# EAGLE schematic teensy-jst_01.4_v5 (EAGLE 9.7.0)
Assembly variants: DNP
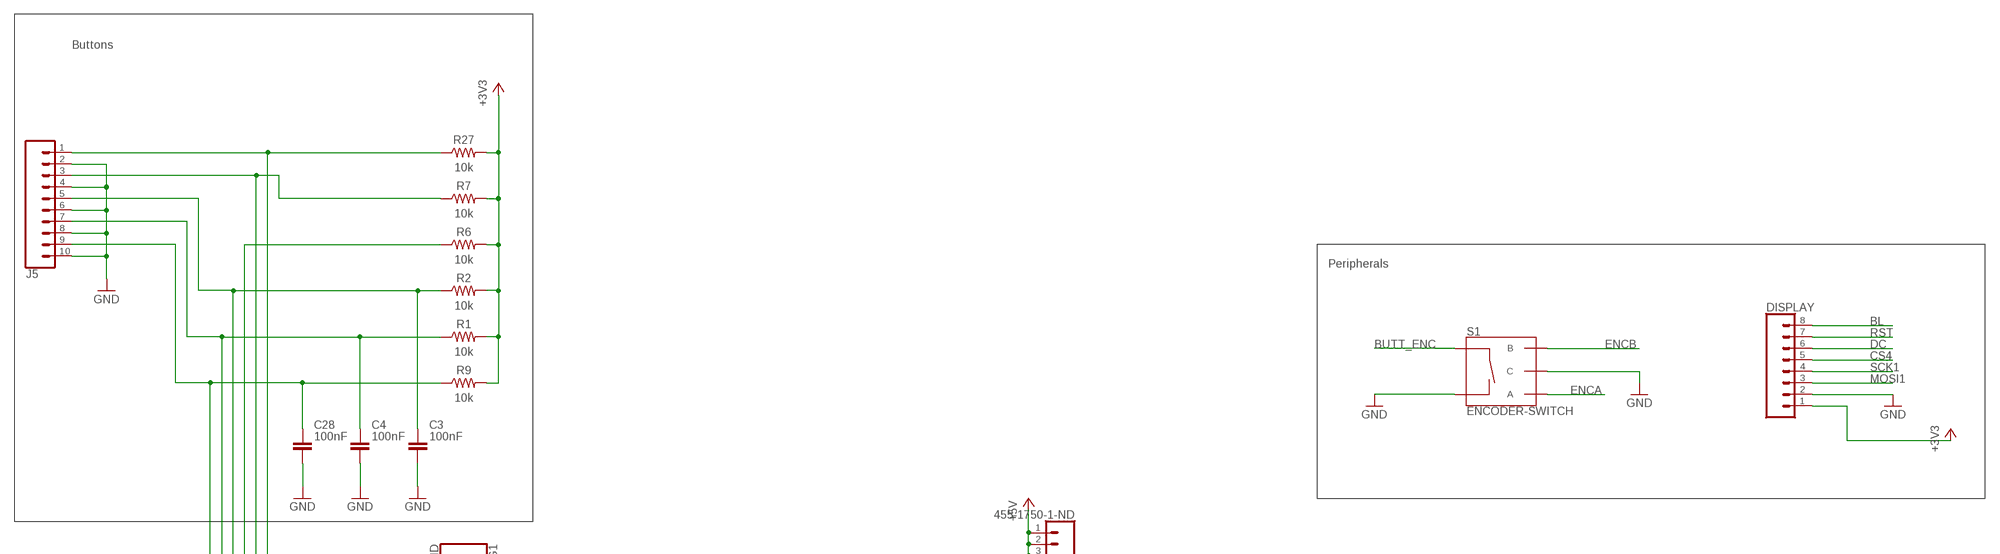
[diagram p0: schematic, sheet 1, part 1 of 3]
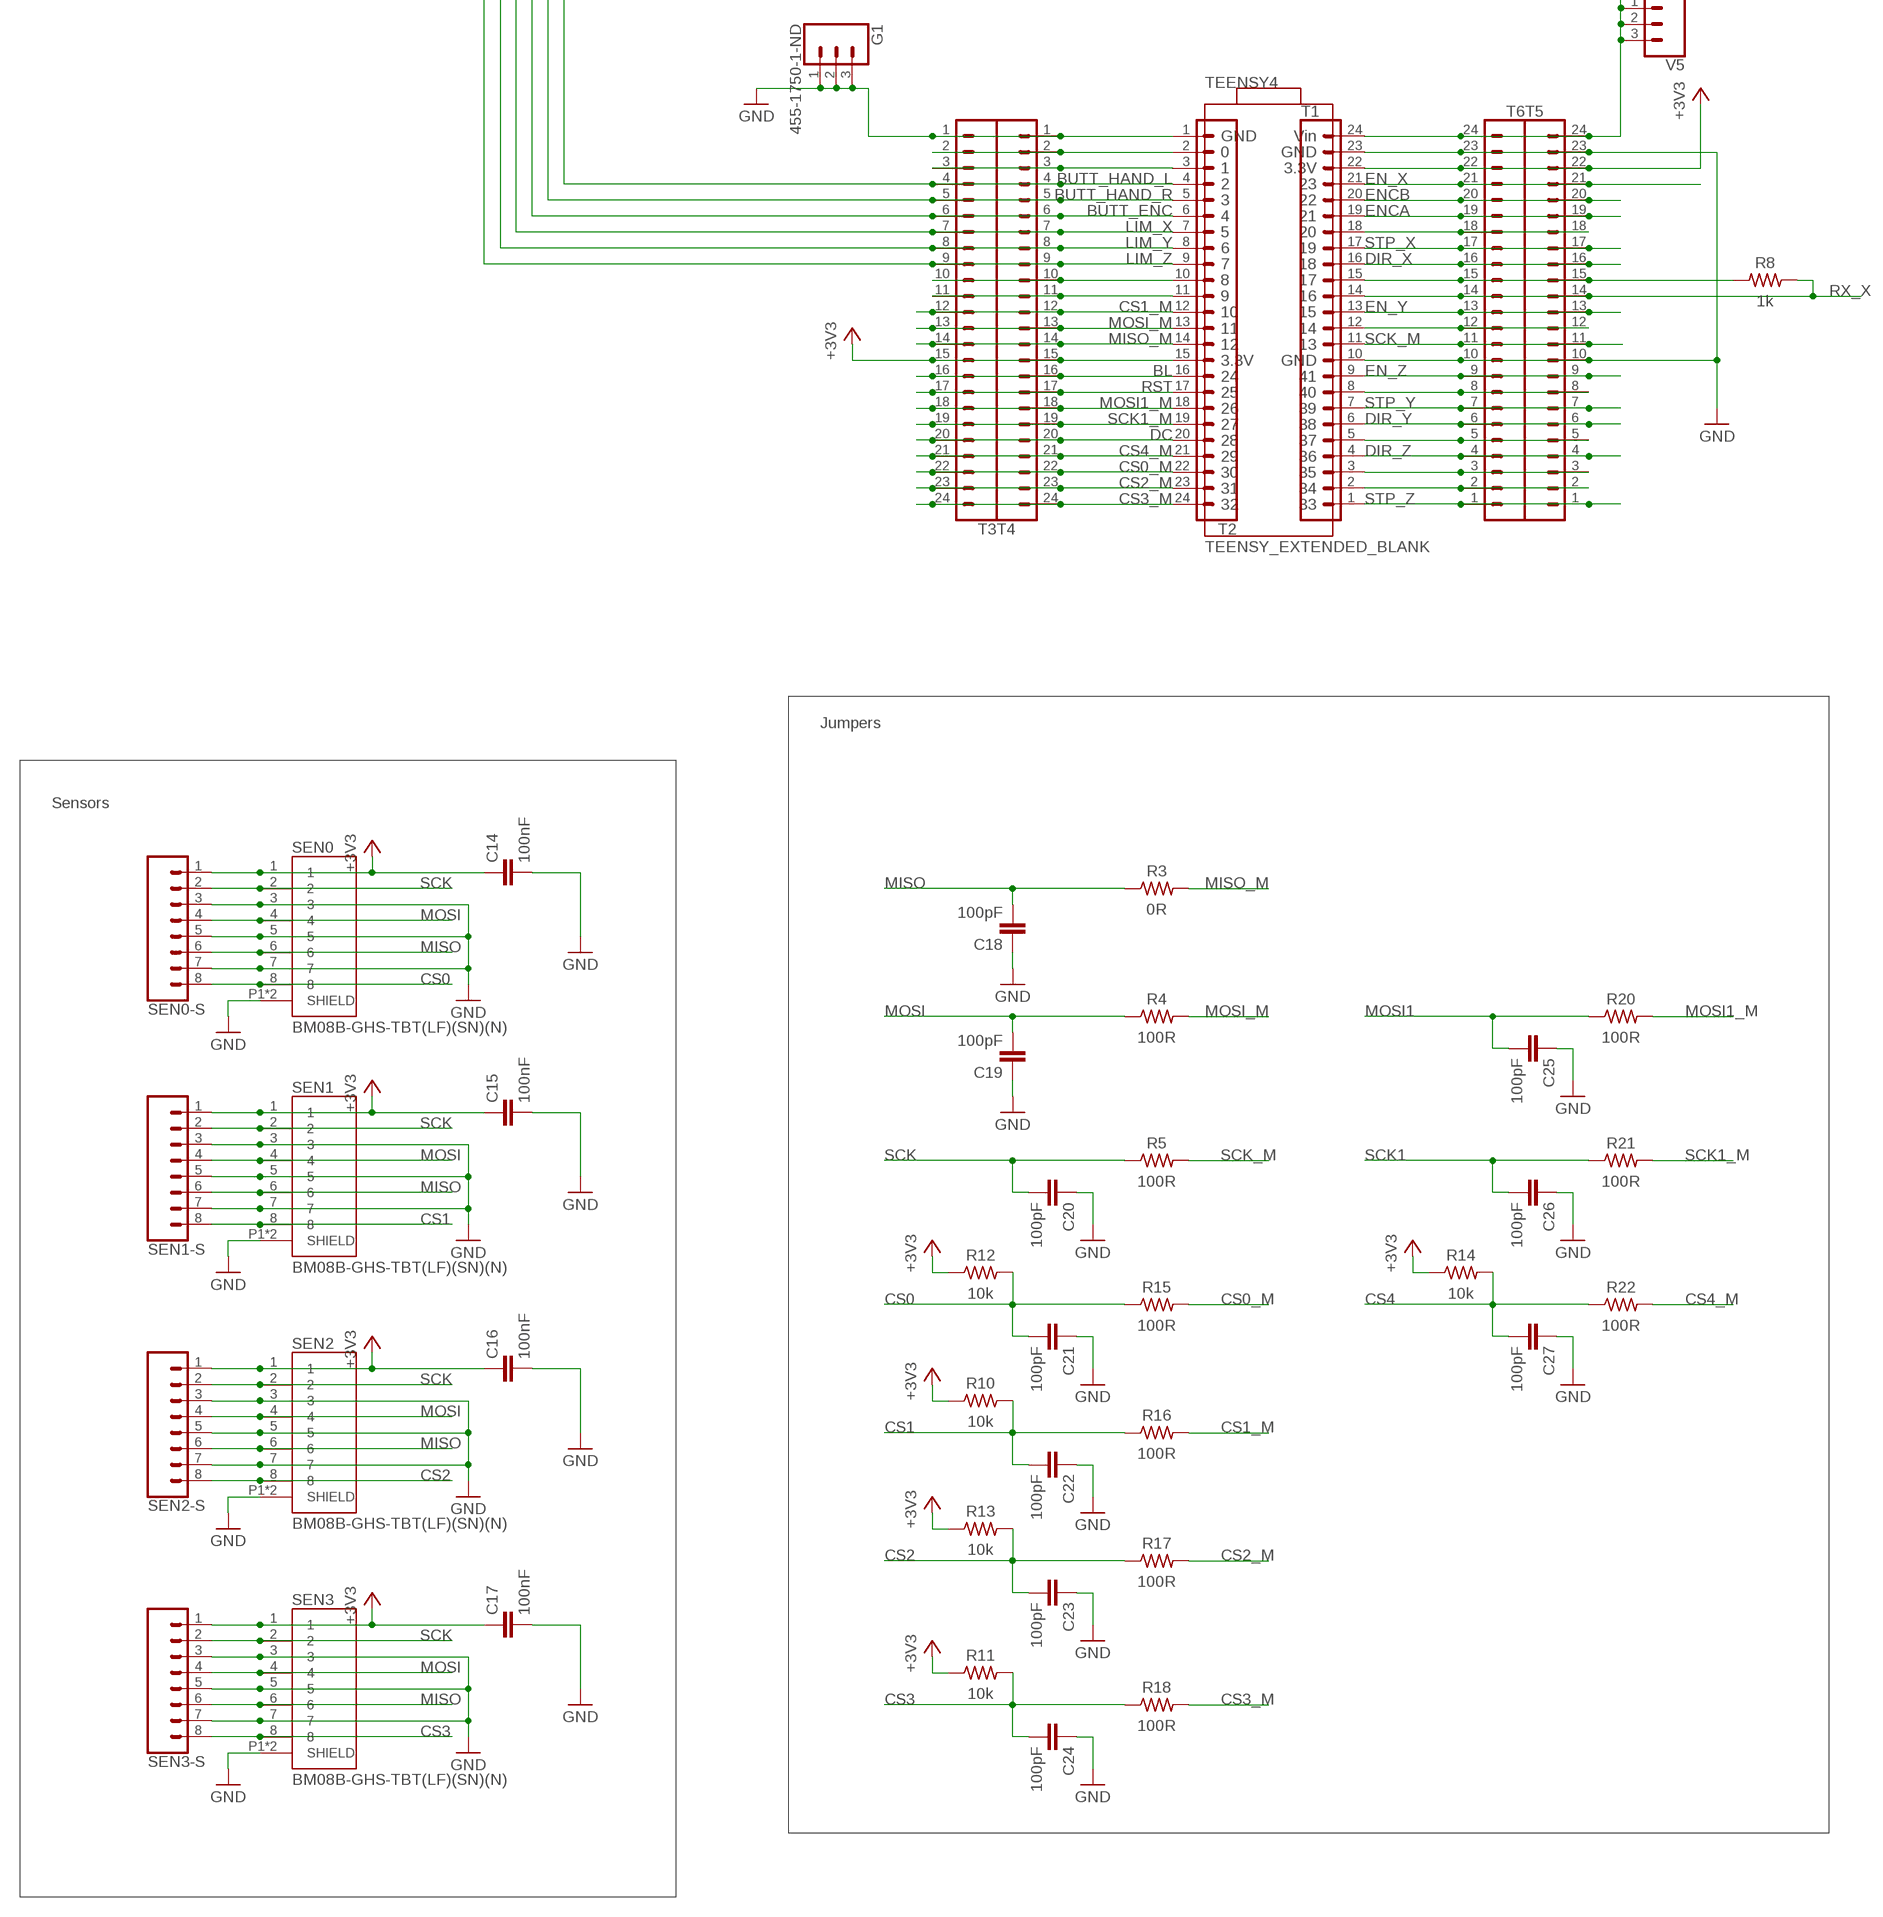
[diagram p1: schematic, sheet 1, part 2 of 3]
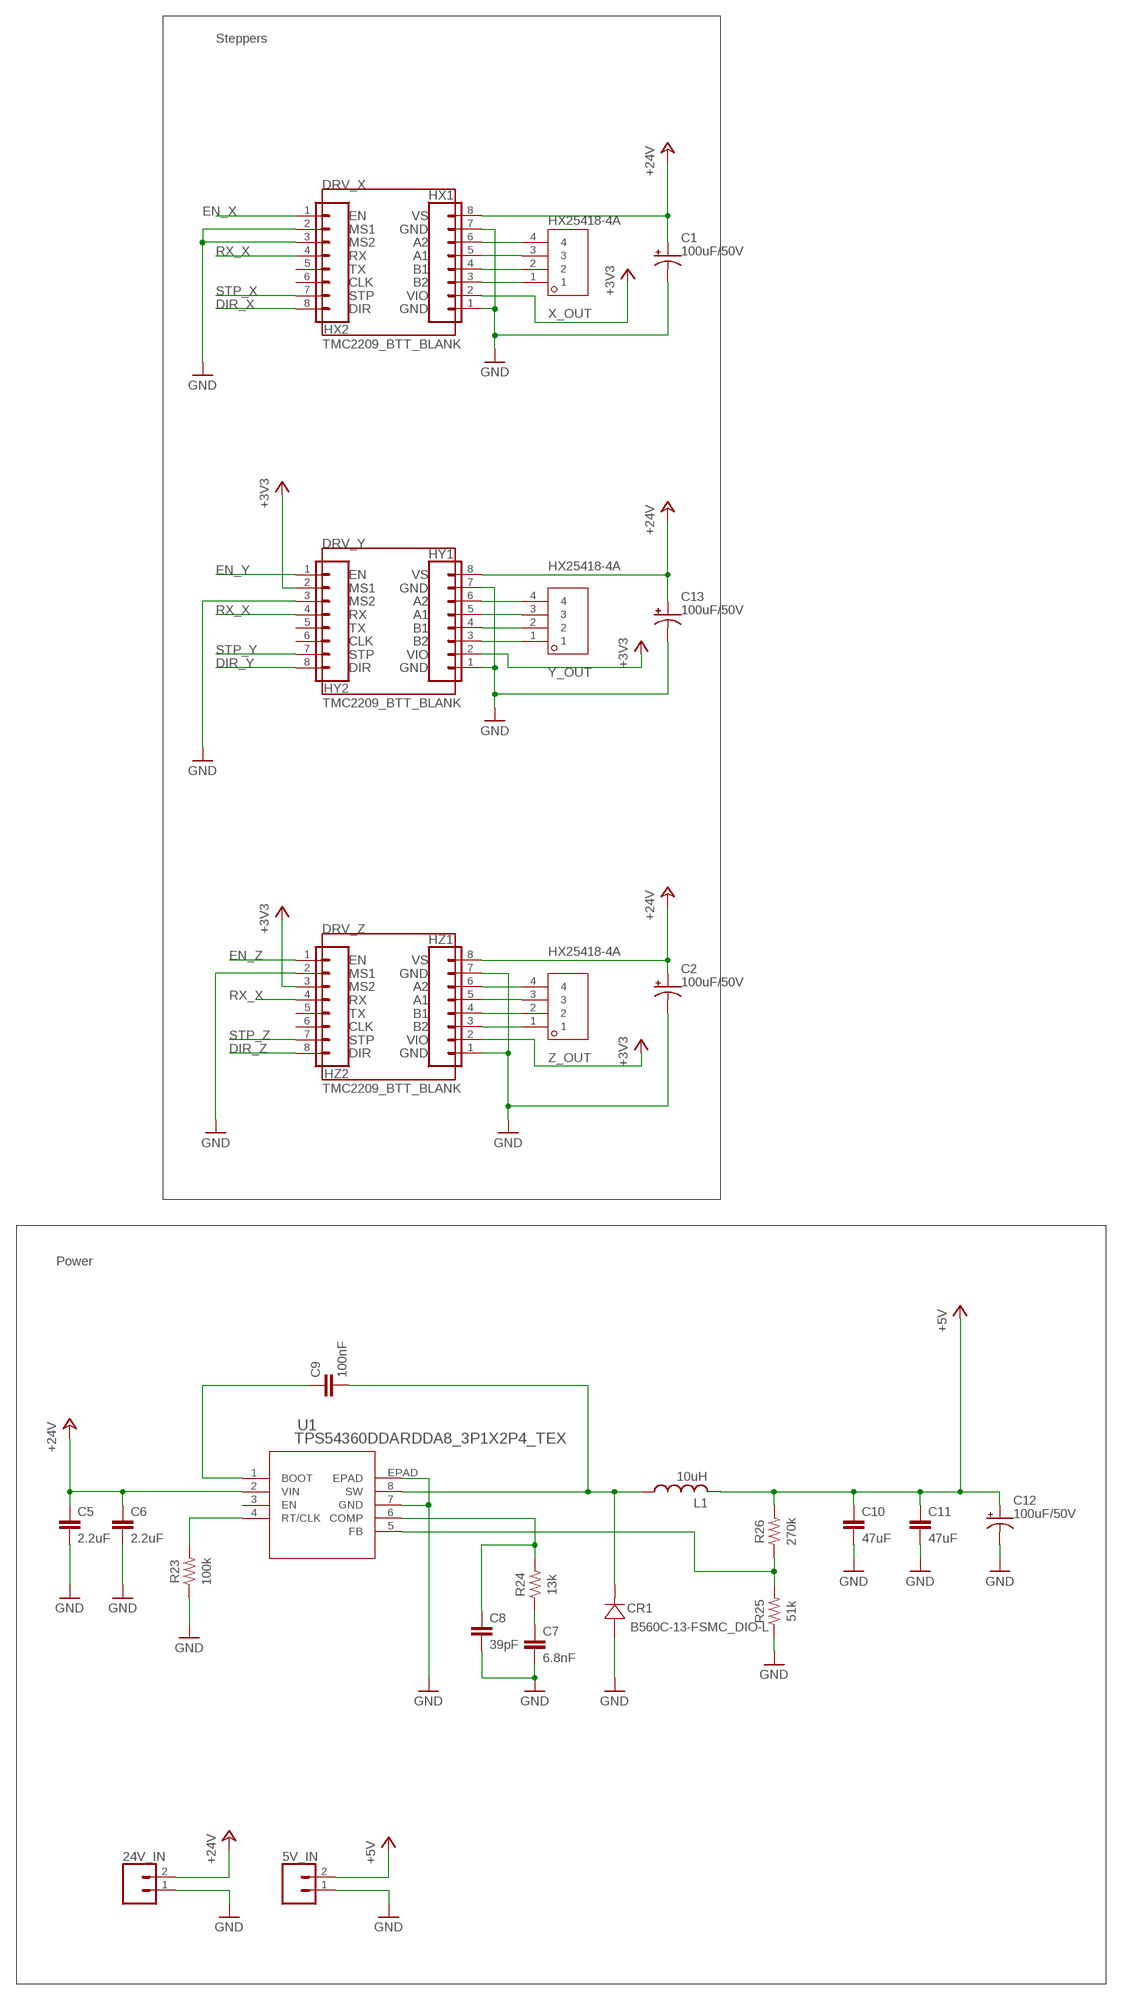
[diagram p2: schematic, sheet 1, part 3 of 3]

## Parts
5V_IN  CONN_025MM  [SCREWTERMINAL-5MM-2]
24V_IN  CONN_025MM  [SCREWTERMINAL-5MM-2]
C1  100uF/50V  CPOL-USD  [PANASONIC_D]
C2  100uF/50V  CPOL-USD  [PANASONIC_D]
C3  100nF  C-EUC0603  [C0603]
C4  100nF  C-EUC0603  [C0603]
C5  2.2uF  C-EUC0603  [C0603]
C6  2.2uF  C-EUC0603  [C0603]
C7  6.8nF  C-EUC0603  [C0603]
C8  39pF  C-EUC0402  [C0402]
C9  100nF  C-EUC0402  [C0402]
C10  47uF  C-EUC0805  [C0805]
C11  47uF  C-EUC0805  [C0805]
C12  100uF/50V  CPOL-USD  [PANASONIC_D]
C13  100uF/50V  CPOL-USD  [PANASONIC_D]
C14  100nF  C-EUC0402  [C0402]
C15  100nF  C-EUC0402  [C0402]
C16  100nF  C-EUC0402  [C0402]
C17  100nF  C-EUC0402  [C0402]
C18  100pF  C-EUC0402K  [C0402K]  (not fitted in variant DNP)
C19  100pF  C-EUC0402K  [C0402K]  (not fitted in variant DNP)
C20  100pF  C-EUC0402K  [C0402K]  (not fitted in variant DNP)
C21  100pF  C-EUC0402K  [C0402K]  (not fitted in variant DNP)
C22  100pF  C-EUC0402  [C0402]  (not fitted in variant DNP)
C23  100pF  C-EUC0402K  [C0402K]  (not fitted in variant DNP)
C24  100pF  C-EUC0402K  [C0402K]  (not fitted in variant DNP)
C25  100pF  C-EUC0402K  [C0402K]  (not fitted in variant DNP)
C26  100pF  C-EUC0402K  [C0402K]  (not fitted in variant DNP)
C27  100pF  C-EUC0402K  [C0402K]  (not fitted in variant DNP)
C28  100nF  C-EUC0603  [C0603]
CR1  B560C-13-FSMC_DIO-L  [SMC_DIO-L]
DISPLAY  CONN_08"  [1X08]
DRV_X  TMC2209_BTT_BLANK  [MODULE_TMC2209_BTT_BLANK]
DRV_Y  TMC2209_BTT_BLANK  [MODULE_TMC2209_BTT_BLANK]
DRV_Z  TMC2209_BTT_BLANK  [MODULE_TMC2209_BTT_BLANK]
G1  455-1750-1-ND  CONN_03  [1X03]  (not fitted in variant DNP)
HX1  CONN_08"  [1X08]
HX2  CONN_08"  [1X08]
HY1  CONN_08"  [1X08]
HY2  CONN_08"  [1X08]
HZ1  CONN_08"  [1X08]
HZ2  CONN_08"  [1X08]
J5  CONN_10"  [1X10]
L1  10uH  L-USMWSA0503S-100MT  [MWSA0503S-100MT]
R1  10k  R-US_CHIP-0603(1608-METRIC)  [RESC1608X60]
R2  10k  R-US_CHIP-0603(1608-METRIC)  [RESC1608X60]
R3  0R  R-US_CHIP-0603(1608-METRIC)  [RESC1608X60]
R4  100R  R-US_CHIP-0603(1608-METRIC)  [RESC1608X60]
R5  100R  R-US_CHIP-0603(1608-METRIC)  [RESC1608X60]
R6  10k  R-US_CHIP-0603(1608-METRIC)  [RESC1608X60]
R7  10k  R-US_CHIP-0603(1608-METRIC)  [RESC1608X60]
R8  1k  R-US_CHIP-0603(1608-METRIC)  [RESC1608X60]
R9  10k  R-US_CHIP-0603(1608-METRIC)  [RESC1608X60]
R10  10k  R-US_CHIP-0603(1608-METRIC)  [RESC1608X60]
R11  10k  R-US_CHIP-0603(1608-METRIC)  [RESC1608X60]
R12  10k  R-US_CHIP-0603(1608-METRIC)  [RESC1608X60]
R13  10k  R-US_CHIP-0603(1608-METRIC)  [RESC1608X60]
R14  10k  R-US_CHIP-0603(1608-METRIC)  [RESC1608X60]
R15  100R  R-US_CHIP-0603(1608-METRIC)  [RESC1608X60]
R16  100R  R-US_CHIP-0603(1608-METRIC)  [RESC1608X60]
R17  100R  R-US_CHIP-0603(1608-METRIC)  [RESC1608X60]
R18  100R  R-US_CHIP-0603(1608-METRIC)  [RESC1608X60]
R20  100R  R-US_CHIP-0603(1608-METRIC)  [RESC1608X60]
R21  100R  R-US_CHIP-0603(1608-METRIC)  [RESC1608X60]
R22  100R  R-US_CHIP-0603(1608-METRIC)  [RESC1608X60]
R23  100k  R-US_CHIP-0402(1005-METRIC)  [RESC1005X40]
R24  13k  R-US_CHIP-0603(1608-METRIC)  [RESC1608X60]
R25  51k  R-US_CHIP-0603(1608-METRIC)  [RESC1608X60]
R26  270k  R-US_CHIP-0402(1005-METRIC)  [RESC1005X40]
R27  10k  R-US_CHIP-0603(1608-METRIC)  [RESC1608X60]
S1  ENCODER-SWITCH  [ROTARY_ENC_PLAIN]
SEN0  BM08B-GHS-TBT(LF)(SN)(N)  [JST_BM08B-GHS-TBT(LF)(SN)(N)]
SEN0-S  CONN_08"  [1X08]  (not fitted in variant DNP)
SEN1  BM08B-GHS-TBT(LF)(SN)(N)  [JST_BM08B-GHS-TBT(LF)(SN)(N)]
SEN1-S  CONN_08"  [1X08]  (not fitted in variant DNP)
SEN2  BM08B-GHS-TBT(LF)(SN)(N)  [JST_BM08B-GHS-TBT(LF)(SN)(N)]
SEN2-S  CONN_08"  [1X08]  (not fitted in variant DNP)
SEN3  BM08B-GHS-TBT(LF)(SN)(N)  [JST_BM08B-GHS-TBT(LF)(SN)(N)]
SEN3-S  CONN_08"  [1X08]  (not fitted in variant DNP)
T1  CONN_24  [1X24]
T2  CONN_24  [1X24]
T3  CONN_24  [1X24]  (not fitted in variant DNP)
T4  CONN_24  [1X24]  (not fitted in variant DNP)
T5  CONN_24  [1X24]  (not fitted in variant DNP)
T6  CONN_24  [1X24]  (not fitted in variant DNP)
TEENSY4  TEENSY_EXTENDED_BLANK  [TEENSY_EXTENDED_BLANK]
U1  TPS54360DDARDDA8_3P1X2P4_TEX  [DDA8_3P1X2P4_TEX]
V5  455-1750-1-ND  CONN_03  [1X03]  (not fitted in variant DNP)
X_OUT  HX25418-4A  [HX25418-4A]
Y_OUT  HX25418-4A  [HX25418-4A]
Z_OUT  HX25418-4A  [HX25418-4A]

## Nets
+3V3: C14.1 C15.1 C16.1 C17.1 DISPLAY.1 HX1.2 HY1.2 HY2.2 HZ1.2 HZ2.3 R1.2 R2.2 R6.2 R7.2 R9.2 R10.1 R11.1 R12.1 R13.1 R14.1 R27.2 SEN0-S.1 SEN0.1 SEN1-S.1 SEN1.1 SEN2-S.1 SEN2.1 SEN3-S.1 SEN3.1 T1.22 T2.15 T3.15 T4.15 T5.22 T6.22
+5V: 5V_IN.2 C10.1 C11.1 C12.+ L1.2 R26.2 T1.24 T5.24 T6.24 V5.1 V5.2 V5.3
+24V: 24V_IN.2 C1.+ C2.+ C5.1 C6.1 C13.+ HX1.8 HY1.8 HZ1.8 U1.2(VIN)
BL: DISPLAY.8 T2.16 T3.16 T4.16
BUTT_ENC: R6.1 S1.SW+ T2.6 T3.6 T4.6
BUTT_HAND_L: J5.1 R27.1 T2.4 T3.4 T4.4
BUTT_HAND_R: J5.3 R7.1 T2.5 T3.5 T4.5
CS0: C21.2 R12.2 R15.1 SEN0-S.8 SEN0.8
CS0_M: R15.2 T2.22 T3.22 T4.22
CS1: C22.2 R10.2 R16.1 SEN1-S.8 SEN1.8
CS1_M: R16.2 T2.12 T3.12 T4.12
CS2: C23.2 R13.2 R17.1 SEN2-S.8 SEN2.8
CS2_M: R17.2 T2.23 T3.23 T4.23
CS3: C24.2 R11.2 R18.1 SEN3-S.8 SEN3.8
CS3_M: R18.2 T2.24 T3.24 T4.24
CS4: C27.2 DISPLAY.5 R14.2 R22.1
CS4_M: R22.2 T2.21 T3.21 T4.21
DC: DISPLAY.6 T2.20 T3.20 T4.20
DIR_X: HX2.8 T1.16 T5.16 T6.16
DIR_Y: HY2.8 T1.6 T5.6 T6.6
DIR_Z: HZ2.8 T1.4 T5.4 T6.4
EN_X: HX2.1 T1.21 T5.21 T6.21
EN_Y: HY2.1 T1.13 T5.13 T6.13
EN_Z: HZ2.1 T1.9 T5.9 T6.9
ENCA: S1.A T1.19 T5.19 T6.19
ENCB: S1.B T1.20 T5.20 T6.20
GND: 5V_IN.1 24V_IN.1 C1.- C2.- C3.2 C4.2 C5.2 C6.2 C7.2 C8.2 C10.2 C11.2 C12.- C13.- C14.2 C15.2 C16.2 C17.2 C18.1 C19.1 C20.1 C21.1 C22.1 C23.1 C24.1 C25.1 C26.1 C27.1 C28.2 CR1.2 DISPLAY.2 G1.1 G1.2 G1.3 HX1.1 HX1.7 HX2.2 HX2.3 HY1.1 HY1.7 HY2.3 HZ1.1 HZ1.7 HZ2.2 J5.2 J5.4 J5.6 J5.8 J5.10 R23.1 R25.1 S1.C S1.SW- SEN0-S.3 SEN0-S.5 SEN0-S.7 SEN0.3 SEN0.5 SEN0.7 SEN0.P1(SHIELD) SEN0.P2(SHIELD) SEN1-S.3 SEN1-S.5 SEN1-S.7 SEN1.3 SEN1.5 SEN1.7 SEN1.P1(SHIELD) SEN1.P2(SHIELD) SEN2-S.3 SEN2-S.5 SEN2-S.7 SEN2.3 SEN2.5 SEN2.7 SEN2.P1(SHIELD) SEN2.P2(SHIELD) SEN3-S.3 SEN3-S.5 SEN3-S.7 SEN3.3 SEN3.5 SEN3.7 SEN3.P1(SHIELD) SEN3.P2(SHIELD) T1.10 T1.23 T2.1 T3.1 T4.1 T5.10 T5.23 T6.10 T6.23 U1.7(GND) U1.EPAD
LIM_X: C3.1 J5.5 R2.1 T2.7 T3.7 T4.7
LIM_Y: C4.1 J5.7 R1.1 T2.8 T3.8 T4.8
LIM_Z: C28.1 J5.9 R9.1 T2.9 T3.9 T4.9
MISO: C18.2 R3.1 SEN0-S.6 SEN0.6 SEN1-S.6 SEN1.6 SEN2-S.6 SEN2.6 SEN3-S.6 SEN3.6
MISO_M: R3.2 T2.14 T3.14 T4.14
MOSI: C19.2 R4.1 SEN0-S.4 SEN0.4 SEN1-S.4 SEN1.4 SEN2-S.4 SEN2.4 SEN3-S.4 SEN3.4
MOSI1: C25.2 DISPLAY.3 R20.1
MOSI1_M: R20.2 T2.18 T3.18 T4.18
MOSI_M: R4.2 T2.13 T3.13 T4.13
N$1: T2.2 T3.2 T4.2
N$3: T2.3 T3.3 T4.3
N$4: T2.10 T3.10 T4.10
N$6: T2.11 T3.11 T4.11
N$7: R23.2 U1.4(RT/CLK)
N$8: T1.12 T5.12 T6.12
N$10: C7.1 R24.1
N$11: T1.3 T5.3 T6.3
N$12: HZ1.6 Z_OUT.4
N$13: T1.2 T5.2 T6.2
N$14: C8.1 R24.2 U1.6(COMP)
N$15: HZ1.5 Z_OUT.3
N$16: T1.8 T5.8 T6.8
N$17: HX1.6 X_OUT.4
N$18: HX1.5 X_OUT.3
N$19: R25.2 R26.1 U1.5(FB)
N$20: HZ1.4 Z_OUT.2
N$21: HZ1.3 Z_OUT.1
N$22: T1.18 T5.18 T6.18
N$23: HY1.4 Y_OUT.2
N$24: HX1.4 X_OUT.2
N$25: HX1.3 X_OUT.1
N$27: T1.5 T5.5 T6.5
N$28: R8.1 T1.15 T5.15 T6.15
N$29: HY1.3 Y_OUT.1
N$30: C9.2 CR1.1 L1.1 U1.8(SW)
N$32: C9.1 U1.1(BOOT)
N$36: HY1.6 Y_OUT.4
N$38: HY1.5 Y_OUT.3
RST: DISPLAY.7 T2.17 T3.17 T4.17
RX_X: HX2.4 HY2.4 HZ2.4 R8.2 T1.14 T5.14 T6.14
SCK: C20.2 R5.1 SEN0-S.2 SEN0.2 SEN1-S.2 SEN1.2 SEN2-S.2 SEN2.2 SEN3-S.2 SEN3.2
SCK1: C26.2 DISPLAY.4 R21.1
SCK1_M: R21.2 T2.19 T3.19 T4.19
SCK_M: R5.2 T1.11 T5.11 T6.11
STP_X: HX2.7 T1.17 T5.17 T6.17
STP_Y: HY2.7 T1.7 T5.7 T6.7
STP_Z: HZ2.7 T1.1 T5.1 T6.1
Unconnected: HX2.5 HX2.6 HY2.5 HY2.6 HZ2.5 HZ2.6 U1.3(EN)

## Notes on the sheet
- Buttons
- Peripherals
- Steppers
- Jumpers
- Sensors
- Power

## Library data of the parts
5V_IN 24V_IN = SparkFun-Connectors:CONN_02: Multi connection point. Often used as Generic Header-pin footprint for 0.1 inch spaced/style header connections On any of the 0.1 inch spaced packages, you can populate with these: Break Away Headers - Straight <https://www.sparkfun.com/products/116> (PRT-00116) Break Away Male Headers - Right Angle <https://www.sparkfun.com/products/553> (PRT-00553) Female Headers <https://www.sparkfun.com/products/115> (PRT-00115) Break Away Headers - Machine Pin <https://www.sparkfun.com/products/117> (PRT-00117) Break Away Female Headers - Swiss Machine Pin <https://www.sparkfun.com/products/743> (PRT-00743) For SCREWTERMINALS and SPRING TERMINALS visit here: Screw Terimnals on SparkFun.com <https://www.sparkfun.com/search/results?term=Screw+Terminals> (5mm/3.5mm/2.54mm spacing) This device is also useful as a general connection point to wire up your design to another part of your project. Our various solder wires solder well into these plated through hole pads. Hook-Up Wire - Assortment (Stranded, 22 AWG) <https://www.sparkfun.com/products/11375> (PRT-11375) Hook-Up Wire - Assortment (Solid Core, 22 AWG) <https://www.sparkfun.com/products/11367> (PRT-11367) View the entire wire category on our website here <https://www.sparkfun.com/categories/141> Special notes: Molex polarized connector foot print use with: PRT-08233 with associated crimp pins and housings. 2.54_SCREWTERM for use with PRT-10571. 3.5mm Screw Terminal footprints for PRT-08084 5mm Screw Terminal footprints for use with PRT-08432; SF_SKU: PRT-08432
C1 C2 C12 C13 = rcl:CPOL-US: POLARIZED CAPACITOR, American symbol; SPICEPREFIX: C
C3-C11 C14-C28 = rcl:C-EU: CAPACITOR, European symbol; SPICEPREFIX: C
CR1 = 2024-09-23_20-34-24_Library:B560C-13-F; COPYRIGHT: Copyright (C) 2024 Ultra Librarian. All rights reserved.; MANUFACTURER_PART_NUMBER: B560C-13-F; MFR_NAME: Diodes Inc
DISPLAY HX1 HX2 HY1 HY2 HZ1 HZ2 SEN0-S SEN1-S SEN2-S SEN3-S = SparkFun-Connectors:CONN_08: Multi connection point. Often used as Generic Header-pin footprint for 0.1 inch spaced/style header connections On any of the 0.1 inch spaced packages, you can populate with these: Break Away Headers - Straight <https://www.sparkfun.com/products/116> (PRT-00116) Break Away Male Headers - Right Angle <https://www.sparkfun.com/products/553> (PRT-00553) Female Headers <https://www.sparkfun.com/products/115> (PRT-00115) Break Away Headers - Machine Pin <https://www.sparkfun.com/products/117> (PRT-00117) Break Away Female Headers - Swiss Machine Pin <https://www.sparkfun.com/products/743> (PRT-00743) Arduino Stackable Header - 8 Pin <https://www.sparkfun.com/products/9279> (PRT-09279) For SCREWTERMINALS and SPRING TERMINALS visit here: Screw Terimnals on SparkFun.com <https://www.sparkfun.com/search/results?term=Screw+Terminals> (5mm/3.5mm/2.54mm spacing) This device is also useful as a general connection point to wire up your design to another part of your project. Our various solder wires solder well into these plated through hole pads. Hook-Up Wire - Assortment (Stranded, 22 AWG) <https://www.sparkfun.com/products/11375> (PRT-11375) Hook-Up Wire - Assortment (Solid Core, 22 AWG) <https://www.sparkfun.com/products/11367> (PRT-11367) View the entire wire category on our website here <https://www.sparkfun.com/categories/141> Special notes: Molex polarized connector foot print use with SKU : PRT-08231 with associated crimp pins and housings. 1MM SMD Version SKU: PRT-10208 NOTES ON THE VARIANTS LOCK and LOCK_LONGPADS... This footprint was designed to help hold the alignment of a through-hole component (i.e. 6-pin header) while soldering it into place. You may notice that each hole has been shifted either up or down by 0.005 of an inch from it's more standard position (which is a perfectly straight line). This slight alteration caused the pins (the squares in the middle) to touch the edges of the holes. Because they are alternating, it causes a "brace" to hold the component in place. 0.005 has proven to be the perfect amount of "off-center" position when using our standard breakaway headers. Although looks a little odd when you look at the bare footprint, once you have a header in there, the alteration is very hard to notice. Also,if you push a header all the way into place, it is covered up entirely on the bottom side.; PROD_ID: CONN-08438
DRV_X DRV_Y DRV_Z = TMC2209_BIGTREETECH:TMC2209_BTT_BLANK
G1 V5 = SparkFun-Connectors:CONN_03: Multi connection point. Often used as Generic Header-pin footprint for 0.1 inch spaced/style header connections On any of the 0.1 inch spaced packages, you can populate with these: Break Away Headers - Straight <https://www.sparkfun.com/products/116> (PRT-00116) Break Away Male Headers - Right Angle <https://www.sparkfun.com/products/553> (PRT-00553) Female Headers <https://www.sparkfun.com/products/115> (PRT-00115) Break Away Headers - Machine Pin <https://www.sparkfun.com/products/117> (PRT-00117) Break Away Female Headers - Swiss Machine Pin <https://www.sparkfun.com/products/743> (PRT-00743) Stackable Header - 3 Pin (Female, 0.1") <https://www.sparkfun.com/products/13875> (PRT-13875) For SCREWTERMINALS and SPRING TERMINALS visit here: Screw Terimnals on SparkFun.com <https://www.sparkfun.com/search/results?term=Screw+Terminals> (5mm/3.5mm/2.54mm spacing) This device is also useful as a general connection point to wire up your design to another part of your project. Our various solder wires solder well into these plated through hole pads. Hook-Up Wire - Assortment (Stranded, 22 AWG) <https://www.sparkfun.com/products/11375> (PRT-11375) Hook-Up Wire - Assortment (Solid Core, 22 AWG) <https://www.sparkfun.com/products/11367> (PRT-11367) View the entire wire category on our website here <https://www.sparkfun.com/categories/141> Special notes: Molex polarized connector foot print use with SKU : PRT-08232 with associated crimp pins and housings.; PROD_ID: XXX-00000
J5 = SparkFun-Connectors:CONN_10: Multi connection point. Often used as Generic Header-pin footprint for 0.1 inch spaced/style header connections On any of the 0.1 inch spaced packages, you can populate with these: Break Away Headers - Straight <https://www.sparkfun.com/products/116> (PRT-00116) Break Away Male Headers - Right Angle <https://www.sparkfun.com/products/553> (PRT-00553) Female Headers <https://www.sparkfun.com/products/115> (PRT-00115) Break Away Headers - Machine Pin <https://www.sparkfun.com/products/117> (PRT-00117) Break Away Female Headers - Swiss Machine Pin <https://www.sparkfun.com/products/743> (PRT-00743) Arduino Stackable Header - 10 Pin <https://www.sparkfun.com/products/11376> (PRT-11376) For SCREWTERMINALS and SPRING TERMINALS visit here: Screw Terimnals on SparkFun.com <https://www.sparkfun.com/search/results?term=Screw+Terminals> (5mm/3.5mm/2.54mm spacing) This device is also useful as a general connection point to wire up your design to another part of your project. Our various solder wires solder well into these plated through hole pads. Hook-Up Wire - Assortment (Stranded, 22 AWG) <https://www.sparkfun.com/products/11375> (PRT-11375) Hook-Up Wire - Assortment (Solid Core, 22 AWG) <https://www.sparkfun.com/products/11367> (PRT-11367) View the entire wire category on our website here <https://www.sparkfun.com/categories/141> Special notes: Molex polarized connector foot print use with SKU : PRT-08231 with associated crimp pins and housings. 1MM SMD Version SKU: PRT-10208 NOTES ON THE VARIANTS LOCK and LOCK_LONGPADS... This footprint was designed to help hold the alignment of a through-hole component (i.e. 6-pin header) while soldering it into place. You may notice that each hole has been shifted either up or down by 0.005 of an inch from it's more standard position (which is a perfectly straight line). This slight alteration caused the pins (the squares in the middle) to touch the edges of the holes. Because they are alternating, it causes a "brace" to hold the component in place. 0.005 has proven to be the perfect amount of "off-center" position when using our standard breakaway headers. Although looks a little odd when you look at the bare footprint, once you have a header in there, the alteration is very hard to notice. Also,if you push a header all the way into place, it is covered up entirely on the bottom side.; PROD_ID: CONN-11563
L1 = rcl-buck:L-US: INDUCTOR, American symbol
R1-R18 R20-R27 = Resistor:R-US: Resistor Fixed - ANSI; CATEGORY: Resistor; SUB-CATEGORY: Fixed
S1 = SparkFun-Switches-Encoder:ENCODER-SWITCH: Rotary Encoder w/ Select Switch Encoders rotate similarly to potentiometers, but they’re different from potentiometers in that an encoder has full rotation without limits. They output gray code so that you can tell how much and in which direction the encoder has been turned. This encoder includes a push-down select switch built into the shaft. SparkFun Products Rotary Encoder <https://www.sparkfun.com/products/9117> (COM-09117); SF_SKU: COM-09117
SEN0 SEN1-SEN3 = BM08B-GHS-TBT_LF__SN__N_:BM08B-GHS-TBT(LF)(SN)(N): Conn Header Gh Top 8pos 1.25mm Check availability <https://pricing.snapeda.com/parts/BM08B-GHS-TBT%28LF%29%28SN%29%28N%29/JST%20Sales/view-part?ref=eda>; AVAILABILITY: In Stock; CHECK_PRICES: https://www.snapeda.com/parts/BM08B-GHS-TBT(LF)(SN)(N)/JST+Sales+America+Inc./view-part/?ref=eda; DESCRIPTION: Connector Header Surface Mount 8 position 0.049 (1.25mm); MF: JST Sales; MP: BM08B-GHS-TBT(LF)(SN)(N); PACKAGE: None; PRICE: None; SNAPEDA_LINK: https://www.snapeda.com/parts/BM08B-GHS-TBT(LF)(SN)(N)/JST+Sales+America+Inc./view-part/?ref=snap
T1-T6 = SparkFun-Connectors:CONN_24: Multi connection point. Often used as Generic Header-pin footprint for 0.1 inch spaced/style header connections On any of the 0.1 inch spaced packages, you can populate with these: Break Away Headers - Straight <https://www.sparkfun.com/products/116> (PRT-00116) Break Away Male Headers - Right Angle <https://www.sparkfun.com/products/553> (PRT-00553) Female Headers <https://www.sparkfun.com/products/115> (PRT-00115) Break Away Headers - Machine Pin <https://www.sparkfun.com/products/117> (PRT-00117) Break Away Female Headers - Swiss Machine Pin <https://www.sparkfun.com/products/743> (PRT-00743) For SCREWTERMINALS and SPRING TERMINALS visit here: Screw Terimnals on SparkFun.com <https://www.sparkfun.com/search/results?term=Screw+Terminals> (5mm/3.5mm/2.54mm spacing) This device is also useful as a general connection point to wire up your design to another part of your project. Our various solder wires solder well into these plated through hole pads. Hook-Up Wire - Assortment (Stranded, 22 AWG) <https://www.sparkfun.com/products/11375> (PRT-11375) Hook-Up Wire - Assortment (Solid Core, 22 AWG) <https://www.sparkfun.com/products/11367> (PRT-11367) View the entire wire category on our website here <https://www.sparkfun.com/categories/141> Special notes: Molex polarized connector foot print use with SKU : PRT-08231 with associated crimp pins and housings. 1MM SMD Version SKU: PRT-10208 NOTES ON THE VARIANTS LOCK and LOCK_LONGPADS... This footprint was designed to help hold the alignment of a through-hole component (i.e. 6-pin header) while soldering it into place. You may notice that each hole has been shifted either up or down by 0.005 of an inch from it's more standard position (which is a perfectly straight line). This slight alteration caused the pins (the squares in the middle) to touch the edges of the holes. Because they are alternating, it causes a "brace" to hold the component in place. 0.005 has proven to be the perfect amount of "off-center" position when using our standard breakaway headers. Although looks a little odd when you look at the bare footprint, once you have a header in there, the alteration is very hard to notice. Also,if you push a header all the way into place, it is covered up entirely on the bottom side.
TEENSY4 = TEENSY-4.1_CLEAN:TEENSY_EXTENDED_BLANK
U1 = 2024-09-23_20-06-51_Library:TPS54360DDAR; COPYRIGHT: Copyright (C) 2024 Ultra Librarian. All rights reserved.; MANUFACTURER_PART_NUMBER: TPS54360DDAR; MFR_NAME: Texas Instruments
X_OUT Y_OUT Z_OUT = HX25418-4A:HX25418-4A